# Altium schematic sheet Alimentação.SchDoc
size A4; Organization: Altium Limited; Address1: L3, 12a Rodborough Rd; Address2: Frenchs Forest; Address3: NSW; Address4: Australia 2086
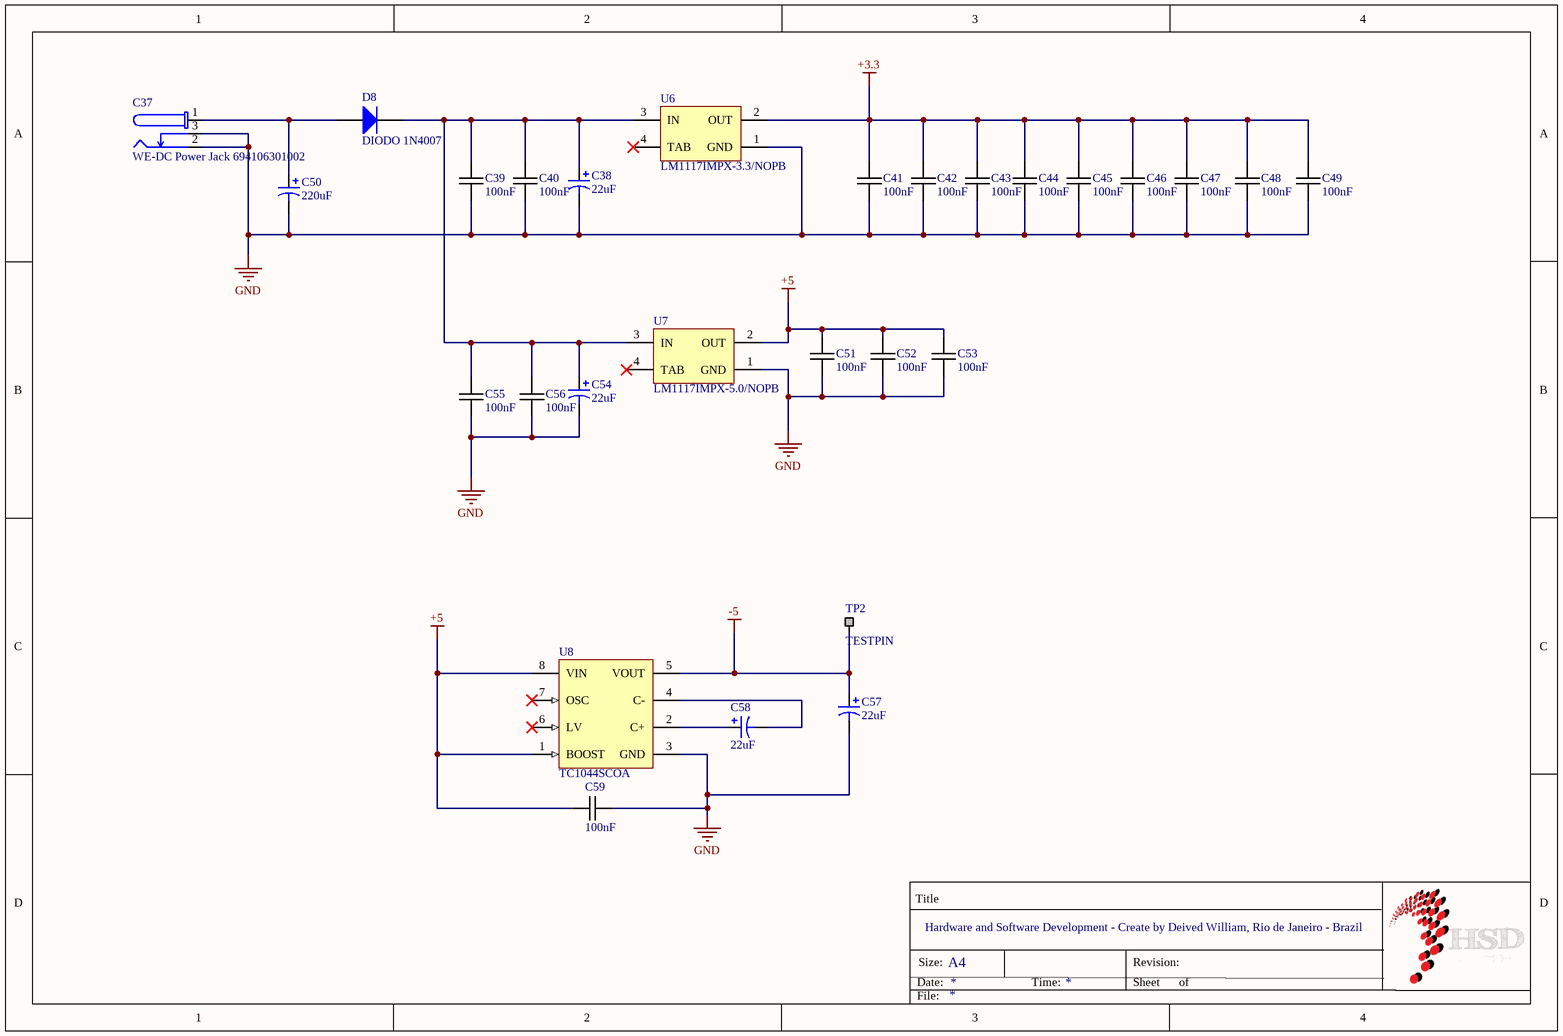
[diagram p0: Alimentação.SchDoc]

## Parts
C37  WE-DC Power Jack 694106301002  [694106301002]
C38  22uF  [D]
C39  100nF  [0603C-GENERIC]
C40  100nF  [0603C-GENERIC]
C41  100nF  [0603C-GENERIC]
C42  100nF  [0603C-GENERIC]
C43  100nF  [0603C-GENERIC]
C44  100nF  [0603C-GENERIC]
C45  100nF  [0603C-GENERIC]
C46  100nF  [0603C-GENERIC]
C47  100nF  [0603C-GENERIC]
C48  100nF  [0603C-GENERIC]
C49  100nF  [0603C-GENERIC]
C50  220uF  [D]
C51  100nF  [0603C-GENERIC]
C52  100nF  [0603C-GENERIC]
C53  100nF  [0603C-GENERIC]
C54  22uF  [D]
C55  100nF  [0603C-GENERIC]
C56  100nF  [0603C-GENERIC]
C57  22uF  [D]
C58  22uF  [D]
C59  100nF  [0603C-GENERIC]
D8  DIODO 1N4007  [DO-41]
TP2  TESTPIN  [TESTPIN]
U6  LM1117IMPX-3.3/NOPB  [MP04A_N]
U7  LM1117IMPX-5.0/NOPB  [MP04A_N]
U8  TC1044SCOA  [SOIC-OA8_N]

## Nets
+3.3: C41.1 C42.1 C43.1 C44.1 C45.1 C46.1 C47.1 C48.1 C49.1 U6.2(OUT)
+5: C51.1 C52.1 C53.1 C59.1 U7.2(OUT) U8.1(BOOST) U8.8(VIN)
-5: C57.1 TP2.1 U8.5(VOUT)
GND: C37.2 C37.3 C38.2 C39.2 C40.2 C41.2 C42.2 C43.2 C44.2 C45.2 C46.2 C47.2 C48.2 C49.2 C50.2 C51.2 C52.2 C53.2 C54.2 C55.2 C56.2 C57.2 C59.2 U6.1(GND) U7.1(GND) U8.3(GND)
NetC37_1: C37.1 C50.1 D8.1(A)
NetC38_1: C38.1 C39.1 C40.1 C54.1 C55.1 C56.1 D8.2(K) U6.3(IN) U7.3(IN)
NetC58_1: C58.1 U8.2(C+)
NetC58_2: C58.2 U8.4(C-)

Not connected (* = marked no-connect by the designer): U6 4(TAB)*; U7 4(TAB)*; U8 6(LV)* 7(OSC)*

## Notes on the sheet
- Title
- Date:
- Size:
- Hardware and Software Development - Create by Deived William, Rio de Janeiro - Brazil
- A4
- Time:
- Revision:
- Sheet
- of
- File:

## Library data of the parts
C37 = WE-DC Power Jack 694106301002: WR-DC_DC Power Jack_Right Angled_THT; Manufacturer: W¨¹rth Elektronik eiSos GmbH; ComponentLink1 Description: Manufacturer; ComponentLink2 Description: Datasheet; NoPins: 3; ComponentLink1URL: http://www.we-online.de; ComponentLink2URL: http://katalog.we-online.de/em/datasheet/6941xx301002.pdf; Created by: Karrer Zheng; Created Date: 10/17/2014; partNo: 694106301002
C38 C50 C54 C57 C58 = CC106D004M: Conformal Coated Solid Tantalum Chip Capacitor: Standard Range, 10uF, 20% Tolerance, 4 WVDC @ -55°C to +85°C, Surge = 5V; Note: See Data Sheet for full range of components; Published: 19-Mar-2004; DatasheetDocument: 21-Mar-2002; PackageReference: D; Publisher: Altium Limited; ComponentLink1Description: Manufacturer Link; ComponentLink1URL: http://www.vishay.com/; ComponentLink2Description: Datasheet; ComponentLink2URL: http://www.vishay.com/docs/43017/ccec.pdf; Value: 10uF
C39-C49 C51-C53 C55 C56 C59 = 0603C-100NF-50V-X7R-TDK: CAPACITOR 0603 CERAMIC; Manufacturer Part Number: C1608X7R1H103K; Manufacturer: TDK Corporation; Temperature Coefficient: X7R; Tolerance: ±10%; Voltage - Rated: 50V; Capacitance: 10000pF; Reel: C68; RoHS: RoHS Compliant; Lead Spacing: -; Package / Case: 0603 (1608 metric); Features: General Purpose; Packaging: Tape & Reel (TR); Thickness: 0.80mm; Operating Temperature: -55°C ~ 125°C; Mounting Type: Surface Mount, MLCC; Category: Capacitors; Supplier 1: Digi-Key; Supplier Part Number 1: 445-1314-2-ND
D8 = DIODO 1N4007: 1 Amp General Purpose Rectifier; Published: 8-Jun-2000; LatestRevisionDate: 17-Jul-2002; LatestRevisionNote: Re-released for DXP Platform.; DatasheetVersion: 1998; PackageVersion: Aug-1999; PackageReference: DO-41; Publisher: Altium Limited; PackageDescription: Diode, Axial; Body 5.2 x 2.7 mm (LxDia. max), Lead Dia. 0.86 mm (max); Code_JEDEC: DO-204-AL; ComponentLink1Description: Manufacturer Link; ComponentLink1URL: http://www.fairchildsemi.com/; ComponentLink2Description: Datasheet; ComponentLink2URL: http://www.fairchildsemi.com/ds/1N%2F1N4001.pdf
TP2 = TESTPIN: TESTPIN SINGLE PIN HEADER; Manufacturer 1: Sharon Long Industries; Manufacturer Part Number 1: Cut-it-yourself; Reel: TH; Supplier 1: Sharon Long Industries; Supplier 1 Part number: Cut-It-Yourself
U6 = LM1117IMPX-3.3/NOPB: 800mA Low-Dropout Linear Regulator, 4-pin SOT-223, Pb-Free; Manufacturer: National Semiconductor; PackageTopMarking: XYTT*N05B; PowerWise: N; CompType: LDO IC; Published: 1-Mar-2010; DatasheetVersion: Apr-2006; PackageVersion: revB, Apr-2003; PackageReference: MP04A; Publisher: Altium Limited; PackageDescription: Molded SOT-223, 6.50 x 3.56 x 1.6mm Body, 4 Lead, 2.3mm Pitch; Supplier 1: Digi-Key; Supplier Part Number 1: LM1117IMPX-3.3-ND; PartNumber: LM1117IMPX-3.3/NOPB; RoHS: Y; PinCount: 4; Code_JEDEC: TO-261-AA; Code_IPC: SOT223-4; ComponentLink1Description: LM1117 Datasheet; ComponentLink1URL: http://www.national.com/ds/LM/LM1117.pdf; ComponentLink2Description: LM1117 Web Page; ComponentLink2URL: http://www.national.com/pf/LM/LM1117.html; ComponentLink3Description: MP04A Package Page; ComponentLink3URL: http://www.national.com/packaging/folders/mp04a.html
U7 = LM1117IMPX-5.0/NOPB: 800mA Low-Dropout Linear Regulator, 4-pin SOT-223, Pb-Free; Manufacturer: National Semiconductor; PackageTopMarking: XYTT*N06B; PowerWise: N; CompType: LDO IC; Published: 1-Mar-2010; DatasheetVersion: Apr-2006; PackageVersion: revB, Apr-2003; PackageReference: MP04A; Publisher: Altium Limited; PackageDescription: Molded SOT-223, 6.50 x 3.56 x 1.6mm Body, 4 Lead, 2.3mm Pitch; Supplier 1: Digi-Key; Supplier Part Number 1: LM1117IMPX-5.0-ND; PartNumber: LM1117IMPX-5.0/NOPB; RoHS: Y; PinCount: 4; Code_JEDEC: TO-261-AA; Code_IPC: SOT223-4; ComponentLink1Description: LM1117 Datasheet; ComponentLink1URL: http://www.national.com/ds/LM/LM1117.pdf; ComponentLink2Description: LM1117 Web Page; ComponentLink2URL: http://www.national.com/pf/LM/LM1117.html; ComponentLink3Description: MP04A Package Page; ComponentLink3URL: http://www.national.com/packaging/folders/mp04a.html
U8 = TC1044SCOA: Charge Pump DC-TO-DC Voltage Converter, 8-Pin SOIC 150mil, Commercial Temperature; Published: 29-Jan-2009; DatasheetVersion: revA, Oct-2002; PackageVersion: revBB, Aug-2009; PackageReference: SOIC-OA8; Publisher: Altium Limited; PackageDescription: 8-Lead Plastic Small Outline (OA) - Narrow, 3.90mm Body [SOIC]; Supplier 1: Digi-Key; Supplier Part Number 1: TC1044SCOA-ND; Code_IPC: SOIC127P600-8; ComponentLink1Description: Datasheet; ComponentLink1URL: http://ww1.microchip.com/downloads/en/DeviceDoc/21348a.pdf; ComponentLink2Description: Packaging Specification; ComponentLink2URL: http://www.microchip.com/stellent/groups/techpub_sg/documents/packagingspec/en012702.pdf; ComponentLink3Description: Microchip.com Home; ComponentLink3URL: http://www.microchip.com/